# EAGLE design JetsonTK1_GPIO_V2 (EAGLE 7.6.0)
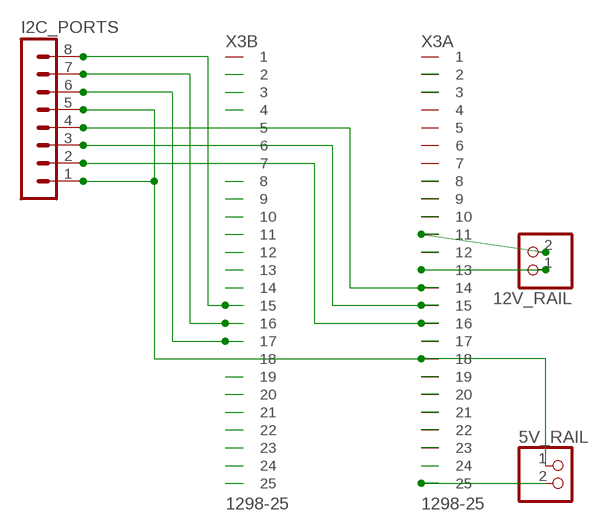
[diagram p0: schematic, sheet 1]

## Parts
5V_RAIL  PINHD-1X2  [1X02]
12V_RAIL  PINHD-1X2  [1X02]
I2C_PORTS  MA08-1  [MA08-1]
X3  1298-25  [1298-25]

## Nets
1.8V: I2C_PORTS.2 X3.A16
3.3V: I2C_PORTS.8 X3.B15
12V: 12V_RAIL.1 X3.A13
GND: 5V_RAIL.1 I2C_PORTS.1 I2C_PORTS.5 X3.A18
GND_12VRAIL: 12V_RAIL.2 X3.A11
N$1: X3.B14
N$2: X3.B2
N$3: X3.B3
N$4: X3.B4
N$5: X3.B5
N$6: X3.B6
N$7: X3.B7
N$8: X3.B8
N$9: X3.B9
N$10: X3.B10
N$11: X3.B11
N$12: X3.B12
N$13: X3.B13
N$14: 5V_RAIL.2 X3.A25
N$15: X3.A24
N$16: X3.B22
N$17: X3.A17
N$18: X3.B18
N$19: X3.B19
N$20: X3.B20
N$21: X3.B21
N$22: X3.A21
N$23: X3.B23
N$24: X3.B24
N$25: X3.B25
N$27: X3.A2
N$28: X3.A3
N$33: X3.A8
N$34: X3.A9
N$35: X3.A10
N$37: X3.A12
N$44: X3.A19
N$45: X3.A20
N$47: X3.A22
N$48: X3.A23
SCL_1.8V_0: I2C_PORTS.3 X3.A15
SCL_3.3V_1: I2C_PORTS.6 X3.B17
SDA_1.8V_0: I2C_PORTS.4 X3.A14
SDA_3.3V_1: I2C_PORTS.7 X3.B16
Unconnected: X3.A1 X3.A4 X3.A5 X3.A6 X3.A7 X3.B1

## Library data of the parts
5V_RAIL 12V_RAIL = pinhead:PINHD-1X2: PIN HEADER
I2C_PORTS = con-lstb:MA08-1: PIN HEADER; OC_FARNELL: unknown; OC_NEWARK: unknown
X3 = con-commcon:1298-25: .800" BOARD SPACE 2mm CONNECTORS - HI TEMP TWO ROW 2mm - STACKTHROUGH; OC_FARNELL: unknown; OC_NEWARK: unknown

## Board
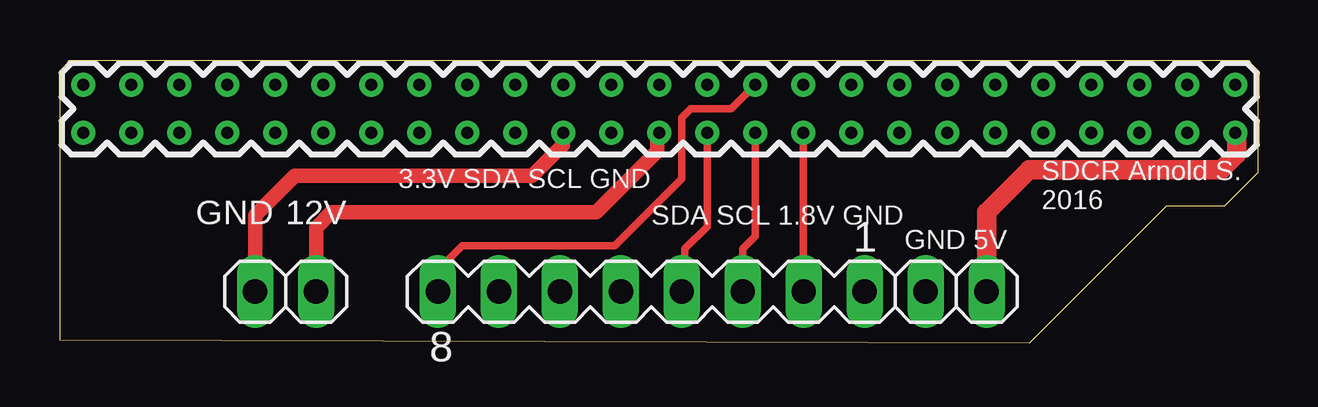
[diagram p1: board, top side]
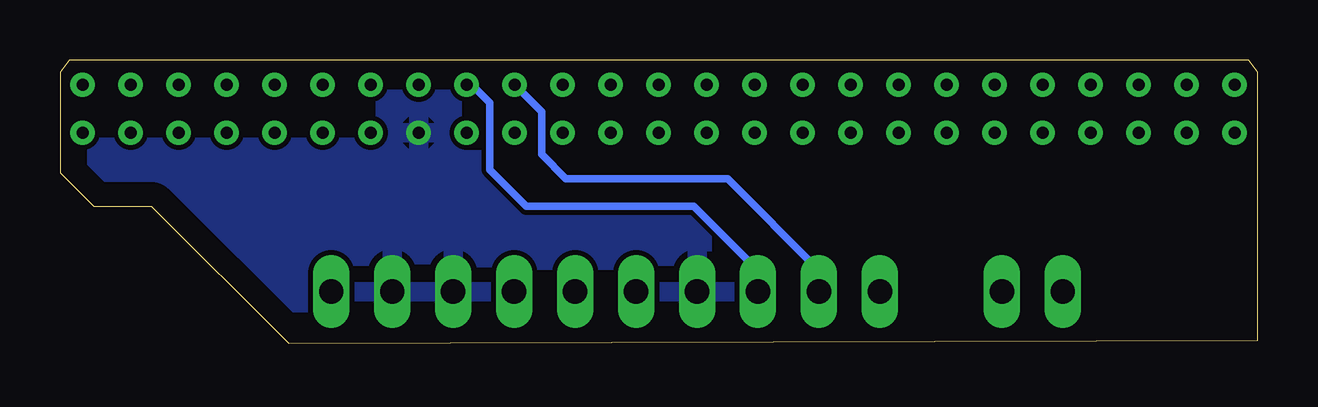
[diagram p2: board, bottom side, seen from below]

Size 49.91 x 11.81 mm. Coordinates in mm from the lower left corner, seen from the top.
Outline: 0.38,11.81 49.53,11.81 49.91,11.3 49.91,7.11 48.51,5.71 46.1,5.71 40.39,0 0,0.13 0,11.3 0.38,11.81
Copper layers (1*16): Top 0.035mm / dielectric 1.5mm / Bottom 0.035mm
Design rules "default": minimum track width 10mil, minimum drill 24mil, track to track 8mil, track to pad 8mil, pad to pad 8mil, via to via 8mil, smd to smd 8mil, copper to edge 40mil, drill to drill 8mil, minimum pad ring 10mil, minimum via ring 8mil, stop-mask expansion 4mil, vias tented up to drill 0mil, thermal gap 10mil

### Footprints (pad centres in the part's own frame; a part is rotated, then mirrored left to right if it is on the bottom)
1X02 = drill 1.016 long: 1 -1.27,0; 2 1.27,0
MA08-1 = drill 1.016 long: 1 -8.89,0; 2 -6.35,0; 3 -3.81,0; 4 -1.27,0; 5 1.27,0; 6 3.81,0; 7 6.35,0; 8 8.89,0
1298-25 = drill 0.508: A1 -24,-1; A2 -22,-1; A3 -20,-1; A4 -18,-1; A5 -16,-1; A6 -14,-1; A7 -12,-1; A8 -10,-1; A9 -8,-1; A10 -6,-1; A11 -4,-1; A12 -2,-1; A13 0,-1; A14 2,-1; A15 4,-1; A16 6,-1; A17 8,-1; A18 10,-1; A19 12,-1; A20 14,-1; A21 16,-1; A22 18,-1; A23 20,-1; A24 22,-1; A25 24,-1; B1 -24,1; B2 -22,1; B3 -20,1; B4 -18,1; B5 -16,1; B6 -14,1; B7 -12,1; B8 -10,1; B9 -8,1; B10 -6,1; B11 -4,1; B12 -2,1; B13 0,1; B14 2,1; B15 4,1; B16 6,1; B17 8,1; B18 10,1; B19 12,1; B20 14,1; B21 16,1; B22 18,1; B23 20,1; B24 22,1; B25 24,1

### Placement (x,y rotation side)
5V_RAIL  37.34,2.16 0 top
12V_RAIL  9.4,2.16 180 top
I2C_PORTS  24.64,2.16 180 top
X3  24.97,9.78 0 top

### Tracks (layer width: path | path; a pad name or v marks a point on that pad's centre or on a via)
1.8V
  Top 0.305: X3.A16 30.97,2.18 I2C_PORTS.2
3.3V
  Top 0.305: I2C_PORTS.8 15.75,3.05 16.76,4.06 23.11,4.06 25.91,6.86 25.91,9.4 26.29,9.78 27.97,9.78 X3.B15
12V
  Top 0.61: 12V_RAIL.1 10.67,4.83 11.3,5.46 22.35,5.46 24.89,8 24.89,8.7 X3.A13
GND
  pour Bottom: 0.38,11.43 49.53,11.43 49.53,7.49 48.26,6.1 45.85,6.1 44.58,4.83 40.13,0.51 4.06,0.64 0.38,0.51
GND_12VRAIL
  Top 0.61: 12V_RAIL.2 8.13,5.33 9.78,6.99 19.69,6.99 20.96,8.26 20.96,8.77 X3.A11
N$14
  Top 0.813: 5V_RAIL.2 38.61,5.46 40.39,7.24 48.39,7.24 49.02,7.87 49.02,8.72 X3.A25
SCL_1.8V_0
  Top 0.305: X3.A15 28.97,4.46 28.45,3.94 I2C_PORTS.3
SCL_3.3V_1
  Bottom 0.305: X3.B17 32.75,10.78 32,10.03 32,7.24 30.48,5.71 23.5,5.71 20.83,3.05 I2C_PORTS.6
SDA_1.8V_0
  Top 0.305: X3.A14 26.97,4.87 26.04,3.94 26.04,2.29 I2C_PORTS.4
SDA_3.3V_1
  Bottom 0.305: I2C_PORTS.7 18.29,3.05 22.1,6.86 28.83,6.86 29.85,7.87 29.85,9.66 X3.B16

### Text on the board
tNames: GND | 12V | 3.3V SDA SCL GND | SDCR Arnold S. / 2016 | SDA SCL 1.8V GND | GND 5V